# EAGLE design Bioreactor Motor PCB (EAGLE 9.2.2)
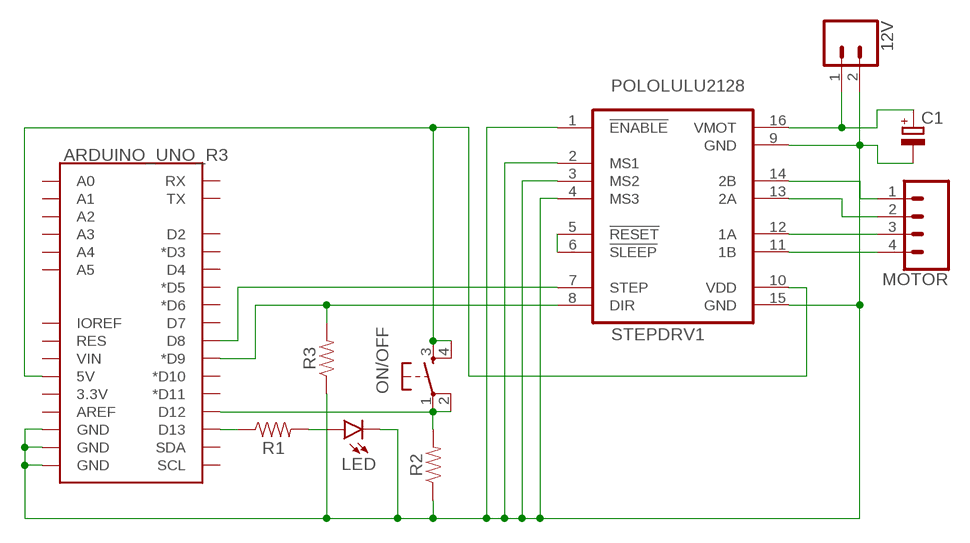
[diagram p0: schematic, sheet 1]

## Parts
12V  CONN_02POLAR  [MOLEX-1X2]
ARDUINO_UNO_R3  ARDUINO_UNO_R3_SHIELDBASIC  [UNO_R3_SHIELD]
C1  CPOL-EUE3.5-8  [E3,5-8]
LED  TLLG4400  [LED3MM]
MOTOR  CONN_04POLAR  [MOLEX-1X4]
ON/OFF  TAC_SWITCHPTH  [TACTILE-PTH]
R1  1M  1MOHM-HORIZ-1/4W-5%  [AXIAL-0.3]
R2  1k  1KOHM-HORIZ-1/4W-1%  [AXIAL-0.3]
R3  1k  1KOHM-HORIZ-1/4W-1%  [AXIAL-0.3]
STEPDRV1  POLOLULU2128  [POLOLULU2128]

## Nets
N$1: 12V.2 ARDUINO_UNO_R3.GND@0(GND) ARDUINO_UNO_R3.GND@1(GND) ARDUINO_UNO_R3.GND@2(GND) C1.- LED.K(C) R2.P$1 R3.P$1 STEPDRV1.1(!ENABLE) STEPDRV1.2(MS1) STEPDRV1.3(MS2) STEPDRV1.4(MS3) STEPDRV1.9(GND) STEPDRV1.15(GND)
N$2: ARDUINO_UNO_R3.D13 R1.P$1
N$3: LED.A R1.P$2
N$4: ARDUINO_UNO_R3.D12 ON/OFF.1 ON/OFF.2 R2.P$2
N$5: ARDUINO_UNO_R3.5V ON/OFF.3 ON/OFF.4 STEPDRV1.10(VDD)
N$6: 12V.1 C1.+ STEPDRV1.16(VMOT)
N$7: STEPDRV1.5(!RESET) STEPDRV1.6(!SLEEP)
N$9: ARDUINO_UNO_R3.D9(*D9) R3.P$2 STEPDRV1.8(DIR)
N$10: ARDUINO_UNO_R3.D8 STEPDRV1.7(STEP)
N$11: MOTOR.4 STEPDRV1.11(1B)
N$12: MOTOR.3 STEPDRV1.12(1A)
N$13: MOTOR.2 STEPDRV1.13(2A)
N$14: MOTOR.1 STEPDRV1.14(2B)
Unconnected: ARDUINO_UNO_R3.3.3V ARDUINO_UNO_R3.A0 ARDUINO_UNO_R3.A1 ARDUINO_UNO_R3.A2 ARDUINO_UNO_R3.A3 ARDUINO_UNO_R3.A4 ARDUINO_UNO_R3.A5 ARDUINO_UNO_R3.AREF ARDUINO_UNO_R3.D2 ARDUINO_UNO_R3.D3(*D3) ARDUINO_UNO_R3.D4 ARDUINO_UNO_R3.D5(*D5) ARDUINO_UNO_R3.D6(*D6) ARDUINO_UNO_R3.D7 ARDUINO_UNO_R3.D10(*D10) ARDUINO_UNO_R3.D11(*D11) ARDUINO_UNO_R3.IOREF ARDUINO_UNO_R3.RES ARDUINO_UNO_R3.RX ARDUINO_UNO_R3.SCL ARDUINO_UNO_R3.SDA ARDUINO_UNO_R3.TX ARDUINO_UNO_R3.VIN

## Library data of the parts
12V = SparkFun-Connectors:CONN_02: Multi connection point. Often used as Generic Header-pin footprint for 0.1 inch spaced/style header connections On any of the 0.1 inch spaced packages, you can populate with these: Break Away Headers - Straight <https://www.sparkfun.com/products/116> (PRT-00116) Break Away Male Headers - Right Angle <https://www.sparkfun.com/products/553> (PRT-00553) Female Headers <https://www.sparkfun.com/products/115> (PRT-00115) Break Away Headers - Machine Pin <https://www.sparkfun.com/products/117> (PRT-00117) Break Away Female Headers - Swiss Machine Pin <https://www.sparkfun.com/products/743> (PRT-00743) For SCREWTERMINALS and SPRING TERMINALS visit here: Screw Terimnals on SparkFun.com <https://www.sparkfun.com/search/results?term=Screw+Terminals> (5mm/3.5mm/2.54mm spacing) This device is also useful as a general connection point to wire up your design to another part of your project. Our various solder wires solder well into these plated through hole pads. Hook-Up Wire - Assortment (Stranded, 22 AWG) <https://www.sparkfun.com/products/11375> (PRT-11375) Hook-Up Wire - Assortment (Solid Core, 22 AWG) <https://www.sparkfun.com/products/11367> (PRT-11367) View the entire wire category on our website here <https://www.sparkfun.com/categories/141> Special notes: Molex polarized connector foot print use with: PRT-08233 with associated crimp pins and housings. 2.54_SCREWTERM for use with PRT-10571. 3.5mm Screw Terminal footprints for PRT-08084 5mm Screw Terminal footprints for use with PRT-08432; SF_ID: PRT-09918
ARDUINO_UNO_R3 = SparkFun-Boards:ARDUINO_UNO_R3_SHIELD: Arduino R3 Shield Footprint Shield form compatible with the Arduino Uno R3. SparkFun Products: MG2639 Cellular Shield <https://www.sparkfun.com/products/13120> MIDI Shield <https://www.sparkfun.com/products/12898> R3 Stackable Headers Kit <https://www.sparkfun.com/products/11417>
C1 = rcl:CPOL-EU: POLARIZED CAPACITOR, European symbol; SPICEPREFIX: C
LED = led:TLLG4400: Low Current (2mA) LED 3 mm Tinted Diffused Package color GREEN Source: Data sheet <http://www.farnell.com/datasheets/391098.pdf>; MF: VISHAY SEMICONDUCTOR; OC_FARNELL: 1612435
MOTOR = SparkFun-Connectors:CONN_04: Multi connection point. Often used as Generic Header-pin footprint for 0.1 inch spaced/style header connections On any of the 0.1 inch spaced packages, you can populate with these: Break Away Headers - Straight <https://www.sparkfun.com/products/116> (PRT-00116) Break Away Male Headers - Right Angle <https://www.sparkfun.com/products/553> (PRT-00553) Female Headers <https://www.sparkfun.com/products/115> (PRT-00115) Break Away Headers - Machine Pin <https://www.sparkfun.com/products/117> (PRT-00117) Break Away Female Headers - Swiss Machine Pin <https://www.sparkfun.com/products/743> (PRT-00743) For SCREWTERMINALS and SPRING TERMINALS visit here: Screw Terimnals on SparkFun.com <https://www.sparkfun.com/search/results?term=Screw+Terminals> (5mm/3.5mm/2.54mm spacing) This device is also useful as a general connection point to wire up your design to another part of your project. Our various solder wires solder well into these plated through hole pads. Hook-Up Wire - Assortment (Stranded, 22 AWG) <https://www.sparkfun.com/products/11375> (PRT-11375) Hook-Up Wire - Assortment (Solid Core, 22 AWG) <https://www.sparkfun.com/products/11367> (PRT-11367) View the entire wire category on our website here <https://www.sparkfun.com/categories/141> Special notes: Molex polarized connector foot print use with SKU : PRT-08231 with associated crimp pins and housings. 1MM SMD Version SKU: PRT-10208; PROD_ID: CONN-08186; SF_ID: PRT-08231
ON/OFF = SparkFun-Retired:TAC_SWITCH: Momentary Switch Button commonly used for reset or general input. Spark Fun Electronics SKU : COM-00097 SMT- SWCH-08247
R1 = SparkFun-Resistors:1MOHM: 1MΩ resistor A resistor is a passive two-terminal electrical component that implements electrical resistance as a circuit element. Resistors act to reduce current flow, and, at the same time, act to lower voltage levels within circuits. - Wikipedia; PROD_ID: RES-09329
R2 R3 = SparkFun-Resistors:1KOHM: 1kΩ resistor A resistor is a passive two-terminal electrical component that implements electrical resistance as a circuit element. Resistors act to reduce current flow, and, at the same time, act to lower voltage levels within circuits. - Wikipedia; PROD_ID: RES-12182
STEPDRV1 = stepper_drivers_etc:POLOLULU2128

## Board
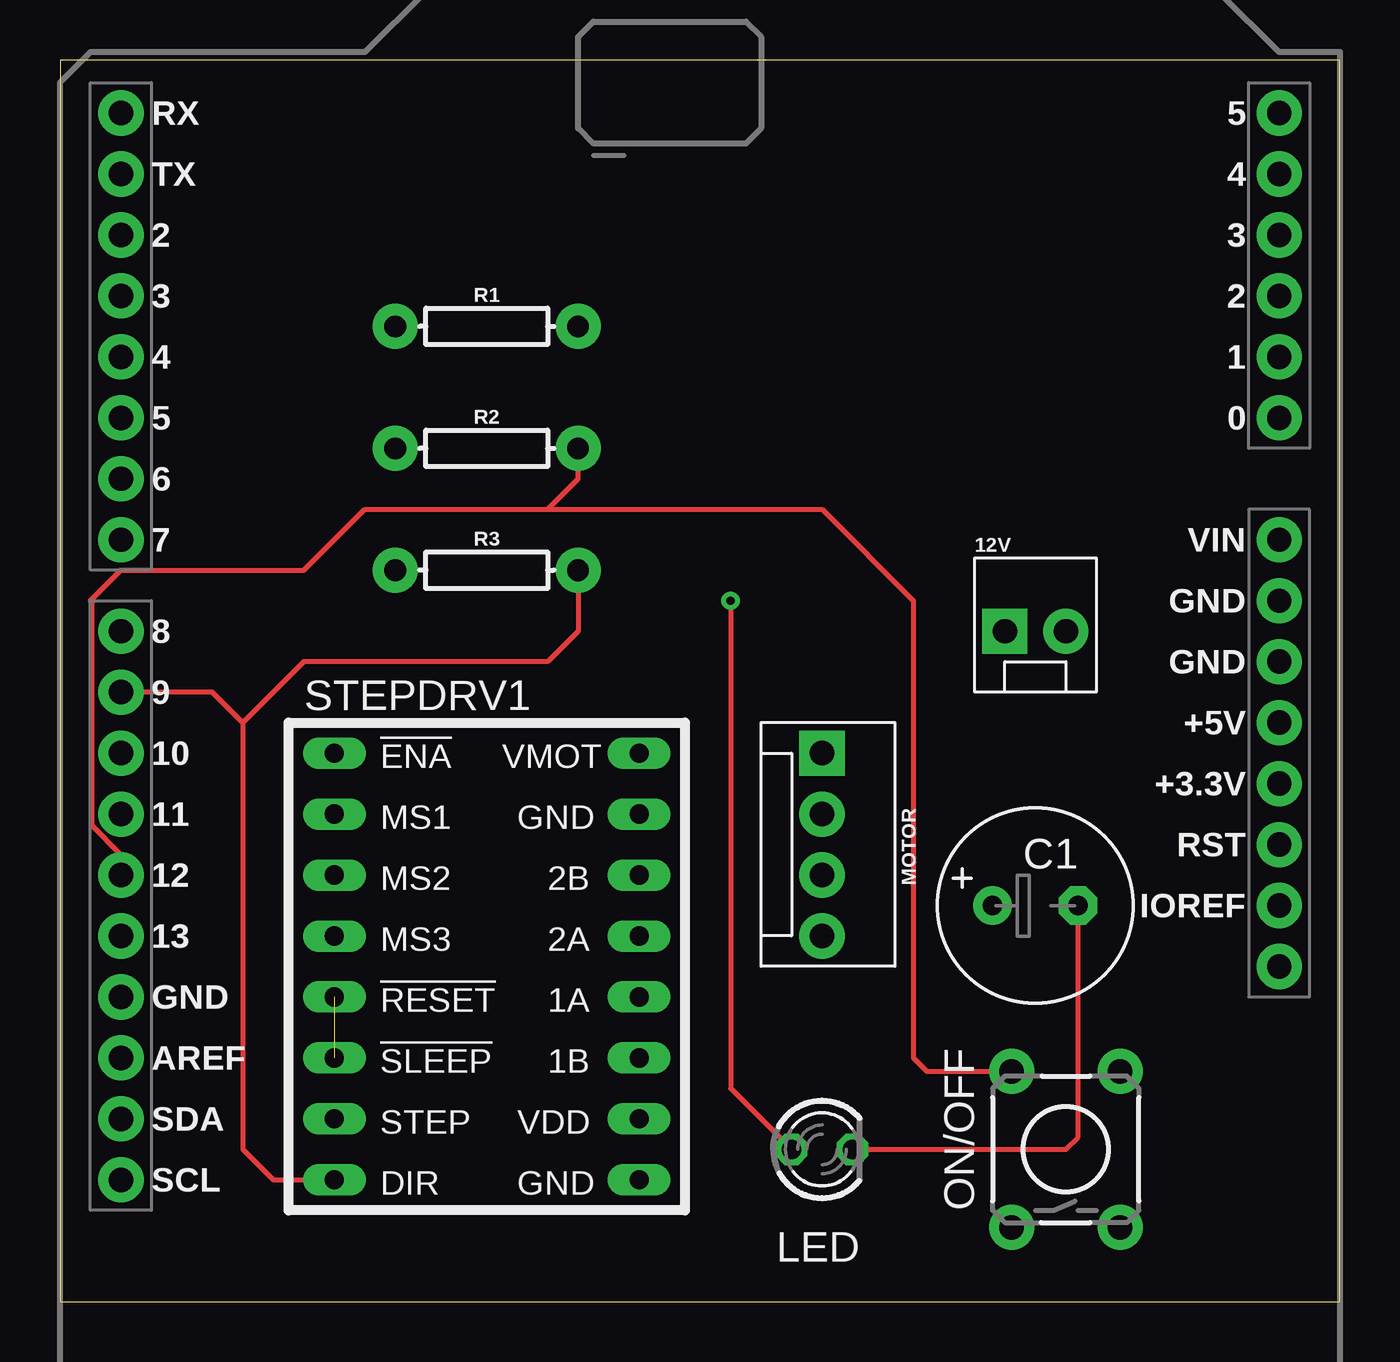
[diagram p1: board, top side]
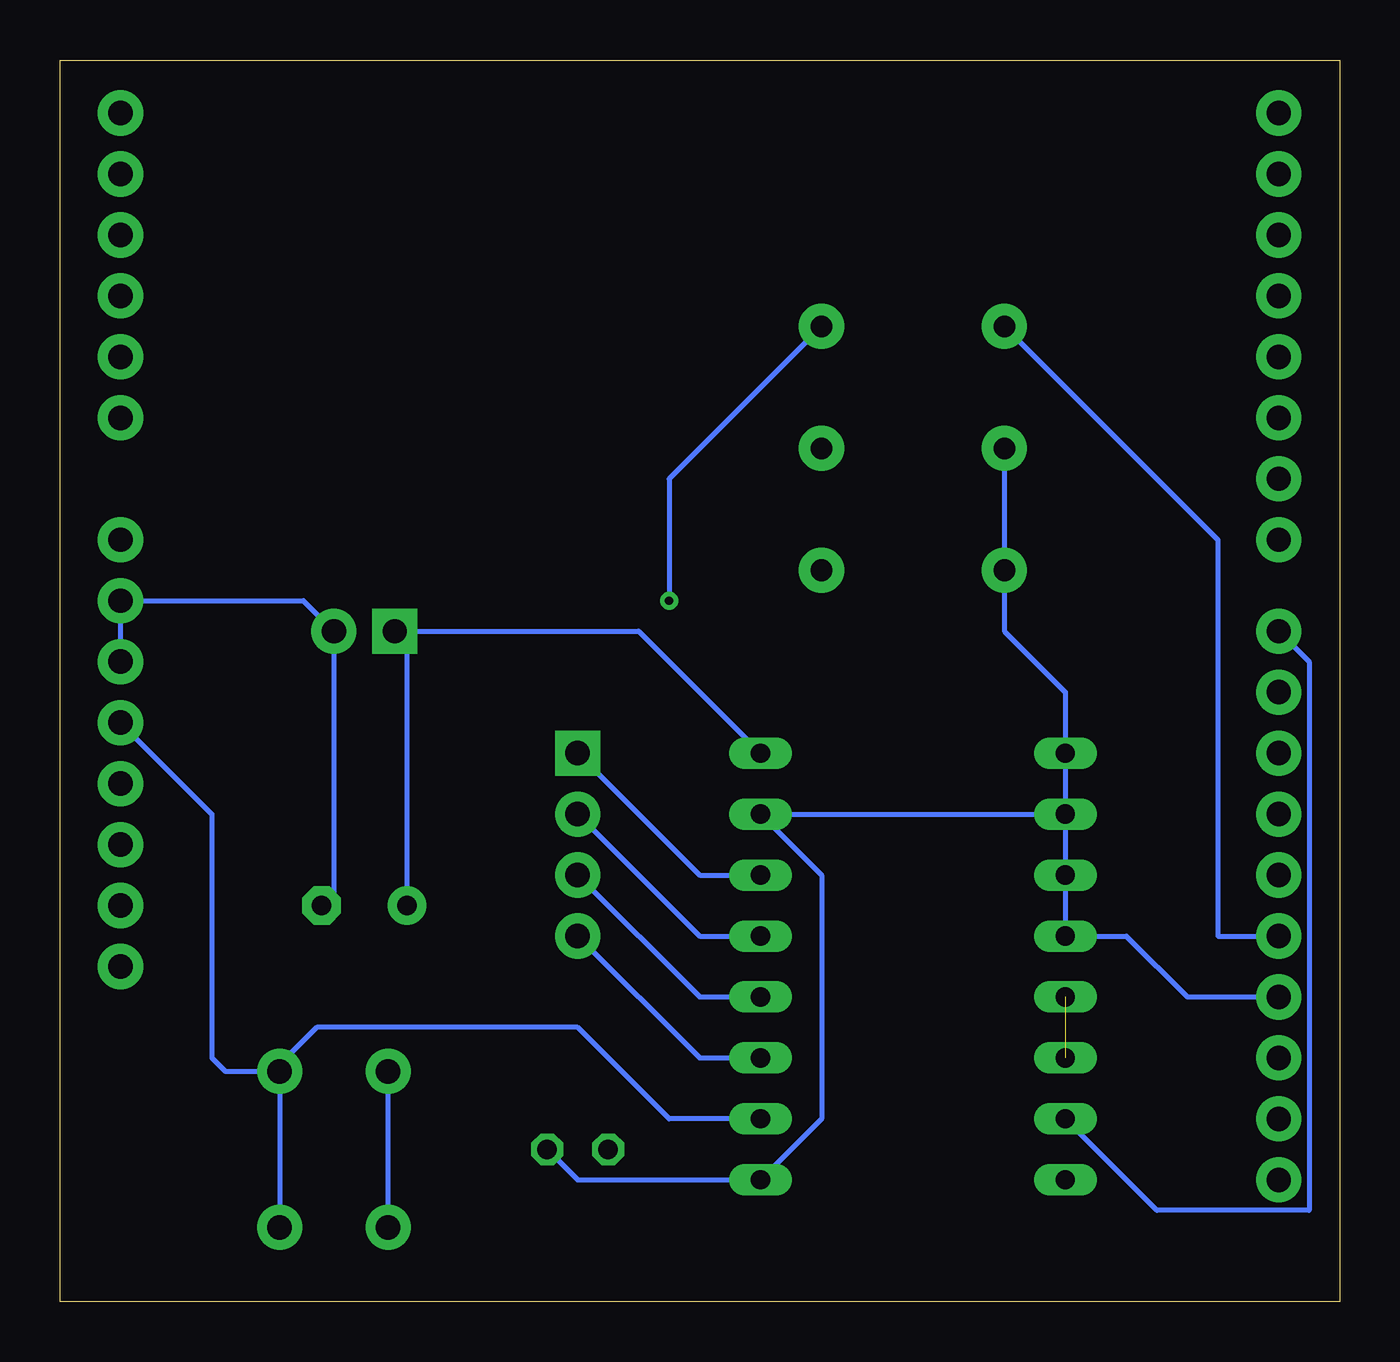
[diagram p2: board, bottom side, seen from below]

Size 53.32 x 51.74 mm. Coordinates in mm from the lower left corner, seen from the top.
Outline: 0,0 53.32,0 53.32,51.74 0,51.74 0,0
Copper layers (1*16): Top 0.035mm / dielectric 1.5mm / Bottom 0.035mm
Design rules "default": minimum track width 6mil, minimum drill 0.35mm, track to track 6mil, track to pad 6mil, pad to pad 6mil, via to via 6mil, smd to smd 6mil, copper to edge 40mil, drill to drill 6mil, minimum pad ring 10mil, minimum via ring 8mil, stop-mask expansion 4mil, vias tented up to drill 0mil, thermal gap 10mil

### Footprints (pad centres in the part's own frame; a part is rotated, then mirrored left to right if it is on the bottom)
MOLEX-1X2 = drill 1.016 pad 1.88 square: 1 0,0 | drill 1.016 pad 1.88: 2 2.54,0
UNO_R3_SHIELD = drill 1.016 pad 1.88: 3.3V 24.13,-2.54; 5V 24.13,0; A0 24.13,12.7; A1 24.13,15.24; A2 24.13,17.78; A3 24.13,20.32; A4 24.13,22.86; A5 24.13,25.4; AREF -24.13,-13.97; D2 -24.13,20.32; D3 -24.13,17.78; D4 -24.13,15.24; D5 -24.13,12.7; D6 -24.13,10.16; D7 -24.13,7.62; D8 -24.13,3.81; D9 -24.13,1.27; D10 -24.13,-1.27; D11 -24.13,-3.81; D12 -24.13,-6.35; D13 -24.13,-8.89; GND@0 24.13,2.54; GND@1 24.13,5.08; GND@2 -24.13,-11.43; IOREF 24.13,-7.62; NC 24.13,-10.16; RES 24.13,-5.08; RX -24.13,25.4; SCL -24.13,-19.05; SDA -24.13,-16.51; TX -24.13,22.86; VIN 24.13,7.62
E3,5-8 = drill 0.813 pad 1.6: + -1.778,0 | drill 0.813 pad 1.6 octagon: - 1.778,0
LED3MM = drill 0.813 octagon: A -1.27,0; K 1.27,0
MOLEX-1X4 = drill 1.016 pad 1.88 square: 1 0,0 | drill 1.016 pad 1.88: 2 2.54,0; 3 5.08,0; 4 7.62,0
TACTILE-PTH = drill 1.016 pad 1.88: 1 -3.251,2.261; 2 3.251,2.261; 3 -3.251,-2.261; 4 3.251,-2.261
AXIAL-0.3 = drill 0.9 pad 1.88: P$1 -3.81,0; P$2 3.81,0
POLOLULU2128 = drill 0.8 long: 1 -7.62,7.62; 2 -7.62,5.08; 3 -7.62,2.54; 4 -7.62,0; 5 -7.62,-2.54; 6 -7.62,-5.08; 7 -7.62,-7.62; 8 -7.62,-10.16; 9 5.08,-10.16; 10 5.08,-7.62; 11 5.08,-5.08; 12 5.08,-2.54; 13 5.08,0; 14 5.08,2.54; 15 5.08,5.08; 16 5.08,7.62

### Placement (x,y rotation side)
12V  39.37,27.94 0 top
ARDUINO_UNO_R3  26.67,24.13 0 top
C1  40.64,16.51 0 top
LED  31.75,6.35 0 top
MOTOR  31.75,22.86 270 top
ON/OFF  41.91,6.35 90 top
R1  17.78,40.64 0 top
R2  17.78,35.56 0 top
R3  17.78,30.48 0 top
STEPDRV1  19.05,15.24 0 top

### Tracks (layer width: path | path; a pad name or v marks a point on that pad's centre or on a via)
N$1
  Top 0.203: LED.K 41.91,6.35 42.42,6.86 C1.-
  Bottom 0.203: R2.P$1 R3.P$1 13.97,27.94 11.43,25.4 STEPDRV1.1 STEPDRV1.2 | STEPDRV1.2 STEPDRV1.3 STEPDRV1.4 8.89,15.24 6.35,12.7 ARDUINO_UNO_R3.GND@2 | STEPDRV1.2 STEPDRV1.15 21.59,17.78 21.59,7.62 STEPDRV1.9 31.75,5.08 LED.K | ARDUINO_UNO_R3.GND@0 ARDUINO_UNO_R3.GND@1 43.18,29.21 12V.2 41.91,17.02 C1.-
N$2
  Bottom 0.203: R1.P$1 5.08,31.75 5.08,15.24 ARDUINO_UNO_R3.D13
N$3  (via drill 0.35)
  Top 0.203: v27.94,29.21 27.94,8.89 LED.A
  Bottom 0.203: R1.P$2 27.94,34.29 v27.94,29.21
N$4
  Top 0.203: ARDUINO_UNO_R3.D12 2.54,18.63 1.35,19.83 1.35,29.13 1.27,29.21 2.54,30.48 10.16,30.48 12.7,33.02 20.32,33.02 | 20.32,33.02 21.59,34.29 R2.P$2 | 20.32,33.02 31.75,33.02 35.56,29.21 35.56,10.16 36.12,9.6 ON/OFF.2
  Bottom 0.203: ON/OFF.1 ON/OFF.2
N$5
  Bottom 0.203: ARDUINO_UNO_R3.5V 46.99,20.32 46.99,10.16 46.43,9.6 44.45,9.6 | 44.45,9.6 ON/OFF.4 ON/OFF.3 | STEPDRV1.10 27.94,7.62 31.75,11.43 42.62,11.43 44.45,9.6
N$6
  Bottom 0.203: STEPDRV1.16 29.21,27.94 12V.1 38.86,27.43 C1.+
N$7  (1 unrouted)
N$9
  Top 0.203: 7.62,24.13 7.62,6.35 8.89,5.08 STEPDRV1.8 | R3.P$2 21.59,27.94 20.32,26.67 10.16,26.67 7.62,24.13 | 7.62,24.13 6.35,25.4 ARDUINO_UNO_R3.D9
N$10
  Bottom 0.203: ARDUINO_UNO_R3.D8 1.27,26.67 1.27,3.81 7.62,3.81 STEPDRV1.7
N$11
  Bottom 0.203: MOTOR.4 26.67,10.16 STEPDRV1.11
N$12
  Bottom 0.203: MOTOR.3 26.67,12.7 STEPDRV1.12
N$13
  Bottom 0.203: MOTOR.2 26.67,15.24 STEPDRV1.13
N$14
  Bottom 0.203: MOTOR.1 26.67,17.78 STEPDRV1.14